# Altium schematic sheet Peripheral_Circuit_A.SchDoc
size A4
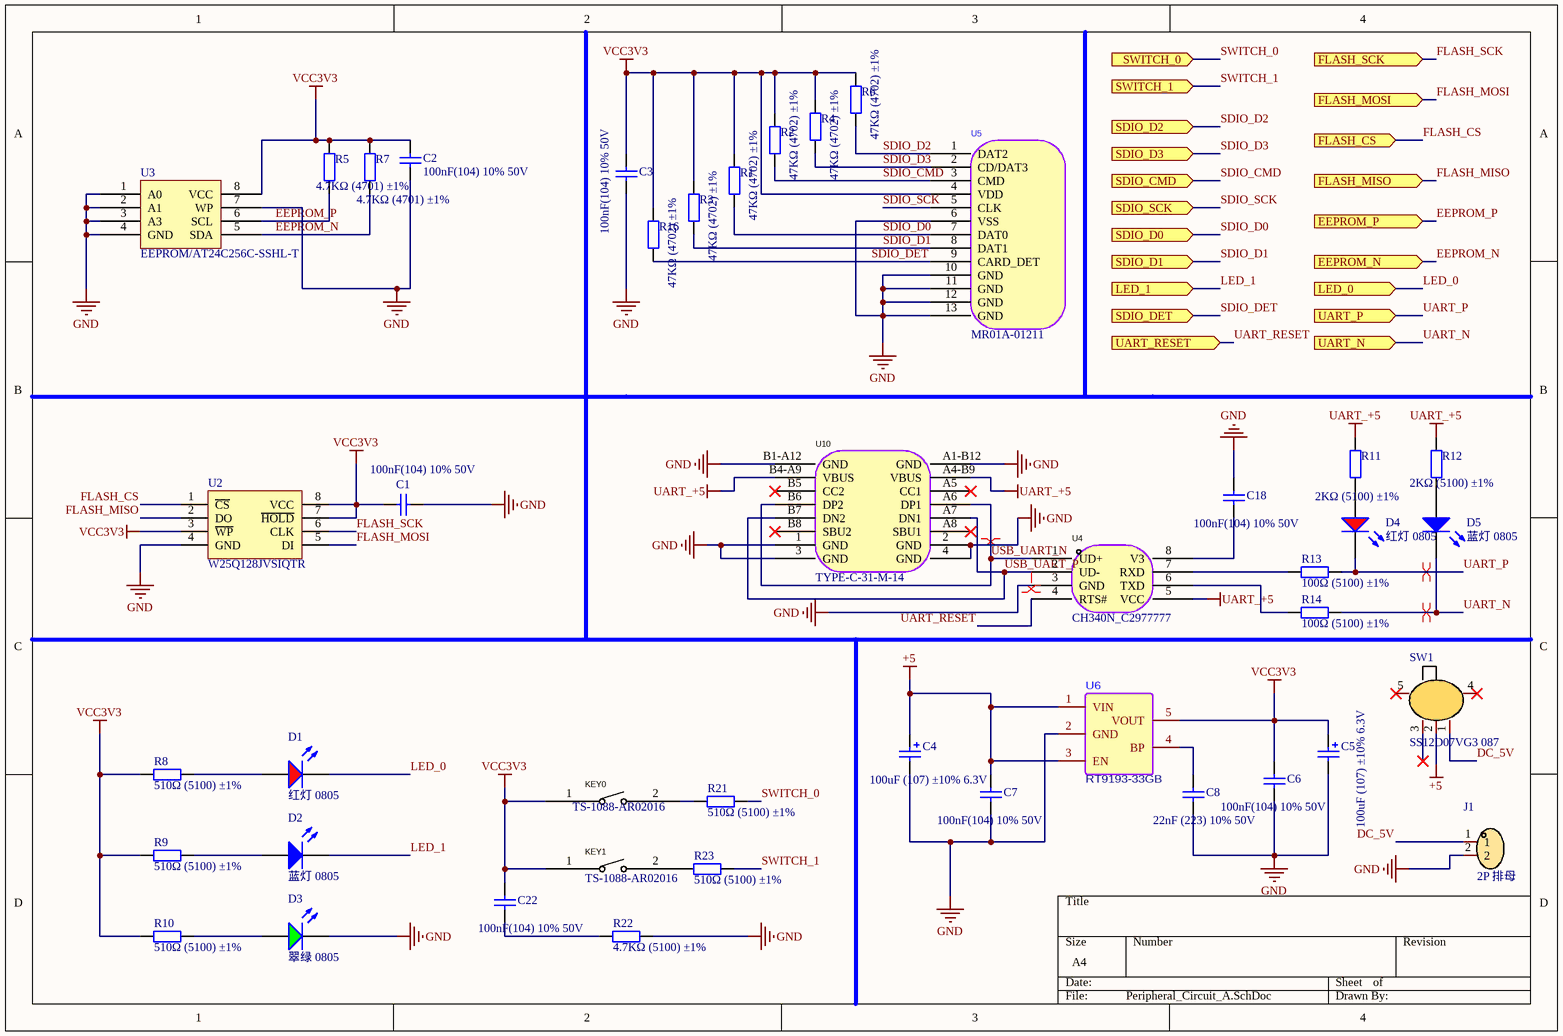
[diagram p0: Peripheral_Circuit_A.SchDoc]

## Parts
C1  100nF(104) 10% 50V  [0805_C]
C2  100nF(104) 10% 50V  [0805_C]
C3  100nF(104) 10% 50V  [0805_C]
C4  100uF (107) ±10% 6.3V  [CASE-B_3528]
C5  100uF (107) ±10% 6.3V  [CASE-B_3528]
C6  100nF(104) 10% 50V  [0805_C]
C7  100nF(104) 10% 50V  [0805_C]
C8  22nF (223) 10% 50V  [0805_C]
C18  100nF(104) 10% 50V  [0805_C]
C22  100nF(104) 10% 50V  [0805_C]
D1  红灯 0805  [0805_LED_S1]
D2  蓝灯 0805  [0805_LED_S1]
D3  翠绿 0805  [0805_LED_S1]
D4  红灯 0805  [0805_LED_S1]
D5  蓝灯 0805  [0805_LED_S1]
J1  2P 排母  [PM254-1-02-W-8.5]
KEY0  TS-1088-AR02016  [SW-SMD_L3.9-W3.0-P4.45]
KEY1  TS-1088-AR02016  [SW-SMD_L3.9-W3.0-P4.45]
R1  47KΩ (4702) ±1%  [0805_R]
R2  47KΩ (4702) ±1%  [0805_R]
R3  47KΩ (4702) ±1%  [0805_R]
R4  47KΩ (4702) ±1%  [0805_R]
R5  4.7KΩ (4701) ±1%  [0805_R]
R6  47KΩ (4702) ±1%  [0805_R]
R7  4.7KΩ (4701) ±1%  [0805_R]
R8  510Ω (5100) ±1%  [0805_R]
R9  510Ω (5100) ±1%  [0805_R]
R10  510Ω (5100) ±1%  [0805_R]
R11  2KΩ (5100) ±1%  [0805_R]
R12  2KΩ (5100) ±1%  [0805_R]
R13  100Ω (5100) ±1%  [0805_R]
R14  100Ω (5100) ±1%  [0805_R]
R16  47KΩ (4702) ±1%  [0805_R]
R21  510Ω (5100) ±1%  [0805_R]
R22  4.7KΩ (5100) ±1%  [0805_R]
R23  510Ω (5100) ±1%  [0805_R]
SW1  SS12D07VG3 087  [SS12D07VG3]
U2  W25Q128JVSIQTR  [CH340_N]
U3  EEPROM/AT24C256C-SSHL-T  [CH340_N]
U4  CH340N_C2977777  [CH340_N]
U5  MR01A-01211  [TF-SMD_MR01A-01211]
U6  RT9193-33GB  [RT9193-33GB]
U10  TYPE-C-31-M-14  [TYPE-C-31-M-14]

## Ports
EEPROM_N (in), EEPROM_P (in), FLASH_CS (in), FLASH_MISO (in), FLASH_MOSI (in), FLASH_SCK (in), LED_0 (in), LED_1 (in), SDIO_CMD (in), SDIO_D0 (in), SDIO_D1 (in), SDIO_D2 (in), SDIO_D3 (in), SDIO_DET (in), SDIO_SCK (in), SWITCH_0 (in), SWITCH_1 (in), UART_N (in), UART_P (in), UART_RESET (in)

## Nets
+5: C4.1 C7.2 SW1.2 U6.1(VIN) U6.3(EN)
GND: C1.2 C2.1 C3.1 C4.2 C5.2 C6.1 C7.1 C8.1 C18.1 D3.K J1.2 R22.1 U2.4(GND) U3.1(A0) U3.2(A1) U3.3(A3) U3.4(GND) U3.7(WP) U4.3(GND) U5.6(VSS) U5.10(GND) U5.11(GND) U5.12(GND) U5.13(GND) U6.2(GND) U10.1(GND) U10.2(GND) U10.3(GND) U10.4(GND) U10.A1-B12(GND) U10.B1-A12(GND)
UART_+5: R11.2 R12.2 U4.5(VCC) U10.A4-B9(VBUS) U10.B4-A9(VBUS)
VCC3V3: C1.1 C2.2 C3.2 C5.1 C6.2 C22.2 KEY0.1 KEY1.1 R1.2 R2.2 R3.2 R4.2 R5.2 R6.2 R7.2 R8.1 R9.1 R10.1 R16.2 U2.3(~{WP}) U2.7(~{HOLD}) U2.8(VCC) U3.8(VCC) U5.4(VDD) U6.5(VOUT)
DC_5V: J1.1 SW1.1
EEPROM_N: R7.1 U3.5(SDA) ; port EEPROM_N
EEPROM_P: R5.1 U3.6(SCL) ; port EEPROM_P
FLASH_CS: U2.1(~{CS}) ; port FLASH_CS
FLASH_MISO: U2.2(DO) ; port FLASH_MISO
FLASH_MOSI: U2.5(DI) ; port FLASH_MOSI
FLASH_SCK: U2.6(CLK) ; port FLASH_SCK
LED_0: D1.K ; port LED_0
LED_1: D2.K ; port LED_1
SDIO_CMD: R2.1 U5.3(CMD) ; port SDIO_CMD
SDIO_D0: R1.1 U5.7(DAT0) ; port SDIO_D0
SDIO_D1: R3.1 U5.8(DAT1) ; port SDIO_D1
SDIO_D2: R6.1 U5.1(DAT2) ; port SDIO_D2
SDIO_D3: R4.1 U5.2(CD/DAT3) ; port SDIO_D3
SDIO_DET: R16.1 U5.9(CARD_DET) ; port SDIO_DET
SDIO_SCK: U5.5(CLK) ; port SDIO_SCK
SWITCH_0: R21.2 ; port SWITCH_0
SWITCH_1: R23.2 ; port SWITCH_1
UART_N: D5.K R14.2 ; port UART_N
UART_P: D4.K R13.2 ; port UART_P
UART_RESET: U4.4(RTS#) ; port UART_RESET
USB_UART_N: U4.1(UD+) U10.A6(DP1) U10.B6(DP2)
USB_UART_P: U4.2(UD-) U10.A7(DN1) U10.B7(DN2)
NetC8_2: C8.2 U6.4(BP)
NetC18_2: C18.2 U4.8(V3)
NetC22_1: C22.1 R22.2
NetD1_A: D1.A R8.2
NetD2_A: D2.A R9.2
NetD3_A: D3.A R10.2
NetD4_A: D4.A R11.1
NetD5_A: D5.A R12.1
NetKEY0_2: KEY0.2 R21.1
NetKEY1_2: KEY1.2 R23.1
NetR13_1: R13.1 U4.7(RXD)
NetR14_1: R14.1 U4.6(TXD)

Not connected (* = marked no-connect by the designer): SW1 3* 4* 5*; U10 A5(CC1)* A8(SBU1)* B5(CC2)* B8(SBU2)*

## Layout directives
differential pair: UART_N, UART_P, USB_UART_N, USB_UART_P

## Library data of the parts
C1-C3 C6 C7 C18 C22 = 0805 100nF(104) 10% 50V: 贴片电容; ComponentLink1Description: 供应商链接; ComponentLink1URL: http://www.szlcsc.com/product/details_50686.html; Package: 0805; Supplier: LC; SuppliersPartNumber: C49678
C4 C5 = 3528 100uF (107) 10% 6.3V: 钽电容; ComponentLink1Description: 供应商链接; ComponentLink1URL: http://www.szlcsc.com/product/details_16815.html; Package: 3528; Supplier: LC; SuppliersPartNumber: C16133
C8 = 0805 22nF (223) 10% 50V: 贴片电容; ComponentLink1Description: 供应商链接; ComponentLink1URL: http://www.szlcsc.com/product/details_2081.html; Package: 0805; Supplier: LC; SuppliersPartNumber: C1729
D1 D4 = 0805 红灯: 发光二极管; ComponentLink1Description: 供应商链接; ComponentLink1URL: http://www.szlcsc.com/product/details_2668.html; Package: 0805; Supplier: LC; SuppliersPartNumber: C2295
D2 D5 = 0805 蓝灯: 发光二极管; ComponentLink1Description: 供应商链接; ComponentLink1URL: http://www.szlcsc.com/product/details_2666.html; Package: 0805; Supplier: LC; SuppliersPartNumber: C2293
D3 = 0805 翠绿: 发光二极管; ComponentLink1Description: 供应商链接; ComponentLink1URL: http://www.szlcsc.com/product/details_2670.html; Package: 0805; Supplier: LC; SuppliersPartNumber: C2297
J1 = PM254-1-02-W-8.5: 2p弯针; Manufacturer: HCTL(华灿天禄); Add into BOM: yes; Holes Structure: 1x2P; Pitch: 2.54mm; Circular Hole / Square Hole: 方孔; Current Rating (Max): 3A; Holes Direction: 侧面; Symbol: PM254-1-02-W-8.5; Device: PM254-1-02-W-8.5; Supplier: LCSC; Supplier Part: C2897384; Manufacturer Part: PM254-1-02-W-8.5; JLCPCB Part Class: 扩展库; LCSC Part Name: 间距:2.54mm 1x2P 弯插; Supplier Footprint: 弯插,P=2.54mm; Datasheet: https://atta.szlcsc.com/upload/public/pdf/source/20230609/7BA40A3D721268A082DCDEAD4C99131B.pdf; Convert to PCB: yes; Number of Holes: 2P; Mounting Type: 弯插; Number of Rows: 单排; Row Spacing: -; Voltage Rating (Max): -; Insulation Height: 8.5mm; Operating Temperature Range: -40℃~+105℃
KEY0 KEY1 = TS-1088-AR02016: 轻触开关; Manufacturer: XUNPU(讯普); Add into BOM: yes; Circuit: 单刀单掷; Actuator Style: 圆形按钮; Switch Length: 4mm; Switch Width: 3mm; Switch Height: 2mm; Strike Gundam: 不带; Contact Current: 50mA; Voltage Rating (DC): 12V; Insulation Resistance: 100MΩ; Actuator/Cap Color: 黑色; Operating Force: 160gf; Pin Style: SMD接片; Mechanical Life: 10万次; Symbol: TS-1088-AR02016; Device: TS-1088-AR02016; Supplier: LCSC; Supplier Part: C720477; Manufacturer Part: TS-1088-AR02016; JLCPCB Part Class: Extended Part; LCSC Part Name: 4*3*2mm 立贴 轻触开关; Supplier Footprint: SMD; Datasheet: https://atta.szlcsc.com/upload/public/pdf/source/20200810/C720475_60D09DD6C54279ADDB2DC25100F1CC11.pdf; Convert to PCB: yes; Mounting Style: 立贴; Operating Temperature: -30℃~+80℃
R1-R4 R6 R16 = 0805 47KΩ (4702) 1%: 贴片电阻; ComponentLink1Description: 供应商链接; ComponentLink1URL: http://www.szlcsc.com/product/details_18401.html; Package: 0805; Supplier: LC; SuppliersPartNumber: C17713
R5 R7 = 0805 4.7KΩ (4701) 1%: 贴片电阻; ComponentLink1Description: 供应商链接; ComponentLink1URL: http://www.szlcsc.com/product/details_18361.html; Package: 0805; Supplier: LC; SuppliersPartNumber: C17673
R8-R14 R21-R23 = 0805 510Ω (5100) 1%: 贴片电阻; ComponentLink1Description: 供应商链接; ComponentLink1URL: http://www.szlcsc.com/product/details_18422.html; Package: 0805; Supplier: LC; SuppliersPartNumber: C17734
SW1 = SS12D07VG3 087: 直插贴片开关; Manufacturer: SHOU HAN(首韩); Add into BOM: yes; Circuit: 单刀双掷; Pin Style: PC引脚; Switch Length: 8.7mm; Switch Width: 4.4mm; Switch Height: 4.7mm; Current Rating (DC): 500mA; Voltage Rating (DC): 50V; Mechanical Life: 5千次; Symbol: SS12D07VG3 087; Device: SS12D07VG3 087; Supplier: LCSC; Supplier Part: C2939725; Manufacturer Part: SS12D07VG3 087; JLCPCB Part Class: 扩展库; LCSC Part Name: SS12D07VG3 087; Supplier Footprint: 插件; Datasheet: https://atta.szlcsc.com/upload/public/pdf/source/20220106/77EDD450BA7545A1F1665F035F54D3A4.pdf; Convert to PCB: yes; Actuator Style: -; Mounting Style: 立插; Actuator Color: -; Current Rating (AC): -; Voltage Rating (AC): -; Operating Temperature: -10℃~+50℃
U2 = W25Q128JVSIQTR_[C97521]: Flash ROM; ComponentLink1Description: 供应商链接; ComponentLink1URL: https://item.szlcsc.com/98729.html; Package: SOIC-8; Supplier: LC; SuppliersPartNumber: C97521
U3 = EEPROM/AT24C256C-SSHL-T_[C6482]: EEPROM; ComponentLink1Description: 供应商链接; ComponentLink1URL: http://www.szlcsc.com/product/details_6947.html; Package: SOIC-8_150mil; Supplier: LC; SuppliersPartNumber: C6482
U4 = CH340N_C2977777: TTL串口phy; Designer: U?; Symbol: CH340N_C2977777; Device: CH340N_C2977777
U5 = MR01A-01211: Manufacturer: ATOM(爱特姆); Add into BOM: yes; Card Type: MicroSD卡(TF卡); Connector Type: 卡座; Card Connection Mode: 自弹式; Maximum Body Height: 1.85mm; Name: MR01A-01211; Symbol: MR01A-01211; Device: MR01A-01211; LCSC Part Name: MR01A-01211; Supplier Part: C479742; Manufacturer Part: MR01A-01211; Supplier Footprint: SMD; JLCPCB Part Class: Extended Part; Datasheet: https://atta.szlcsc.com/upload/public/pdf/source/20200107/C479742_0284EDD146B0D8F7A9D47B481AEA01A2.pdf; Supplier: LCSC; Convert to PCB: yes; Operating Temperature Range: -25℃~+85℃
U10 = TYPE-C-31-M-14_1: type-c接口; Manufacturer: 韩国韩荣; Add into BOM: yes; Connector Type: Type-C; Gender: 母座; Number of Contacts: 12; Number of Ports: 1; Name: TYPE-C-31-M-14; Symbol: TYPE-C-31-M-14; Device: TYPE-C-31-M-14; LCSC Part Name: TYPE-C-31-M-14; Supplier Part: C223907; Manufacturer Part: TYPE-C-31-M-14; Supplier Footprint: SMD; JLCPCB Part Class: Extended Part; Datasheet: https://atta.szlcsc.com/upload/public/pdf/source/20210810/33D192CE742AF71F47CC03F903000C62.pdf; Supplier: LCSC; Convert to PCB: yes; Standard: -